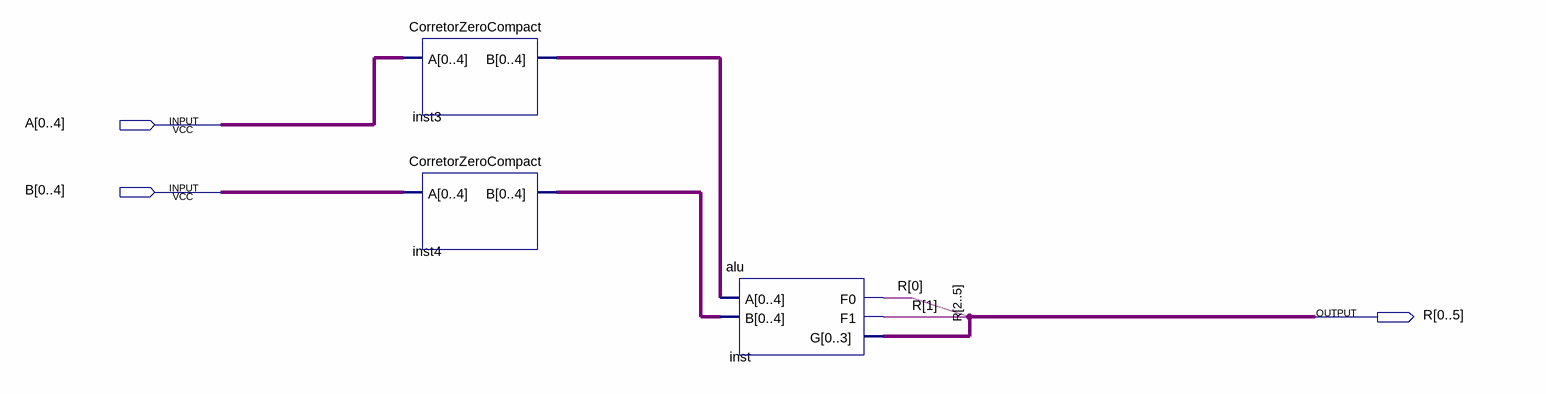
[diagram p0: schematic sheet]
// Quartus schematic Alu_Adder.bdf as structural Verilog: 3 symbols, 3 pins
module Alu_Adder (
  input  [0:4] A,
  input  [0:4] B,
  output [0:5] R
);

  wire [4:0] inst3_b, inst4_b;

  CorretorZeroCompact inst3 (.A(A), .B(inst3_b));
  CorretorZeroCompact inst4 (.A(B), .B(inst4_b));
  alu inst (.A(inst3_b), .B(inst4_b), .F0(R[0]), .F1(R[1]), .G(R[2:5]));
endmodule
